# Altium schematic sheet Thruster_V1.0.SchDoc
size A2
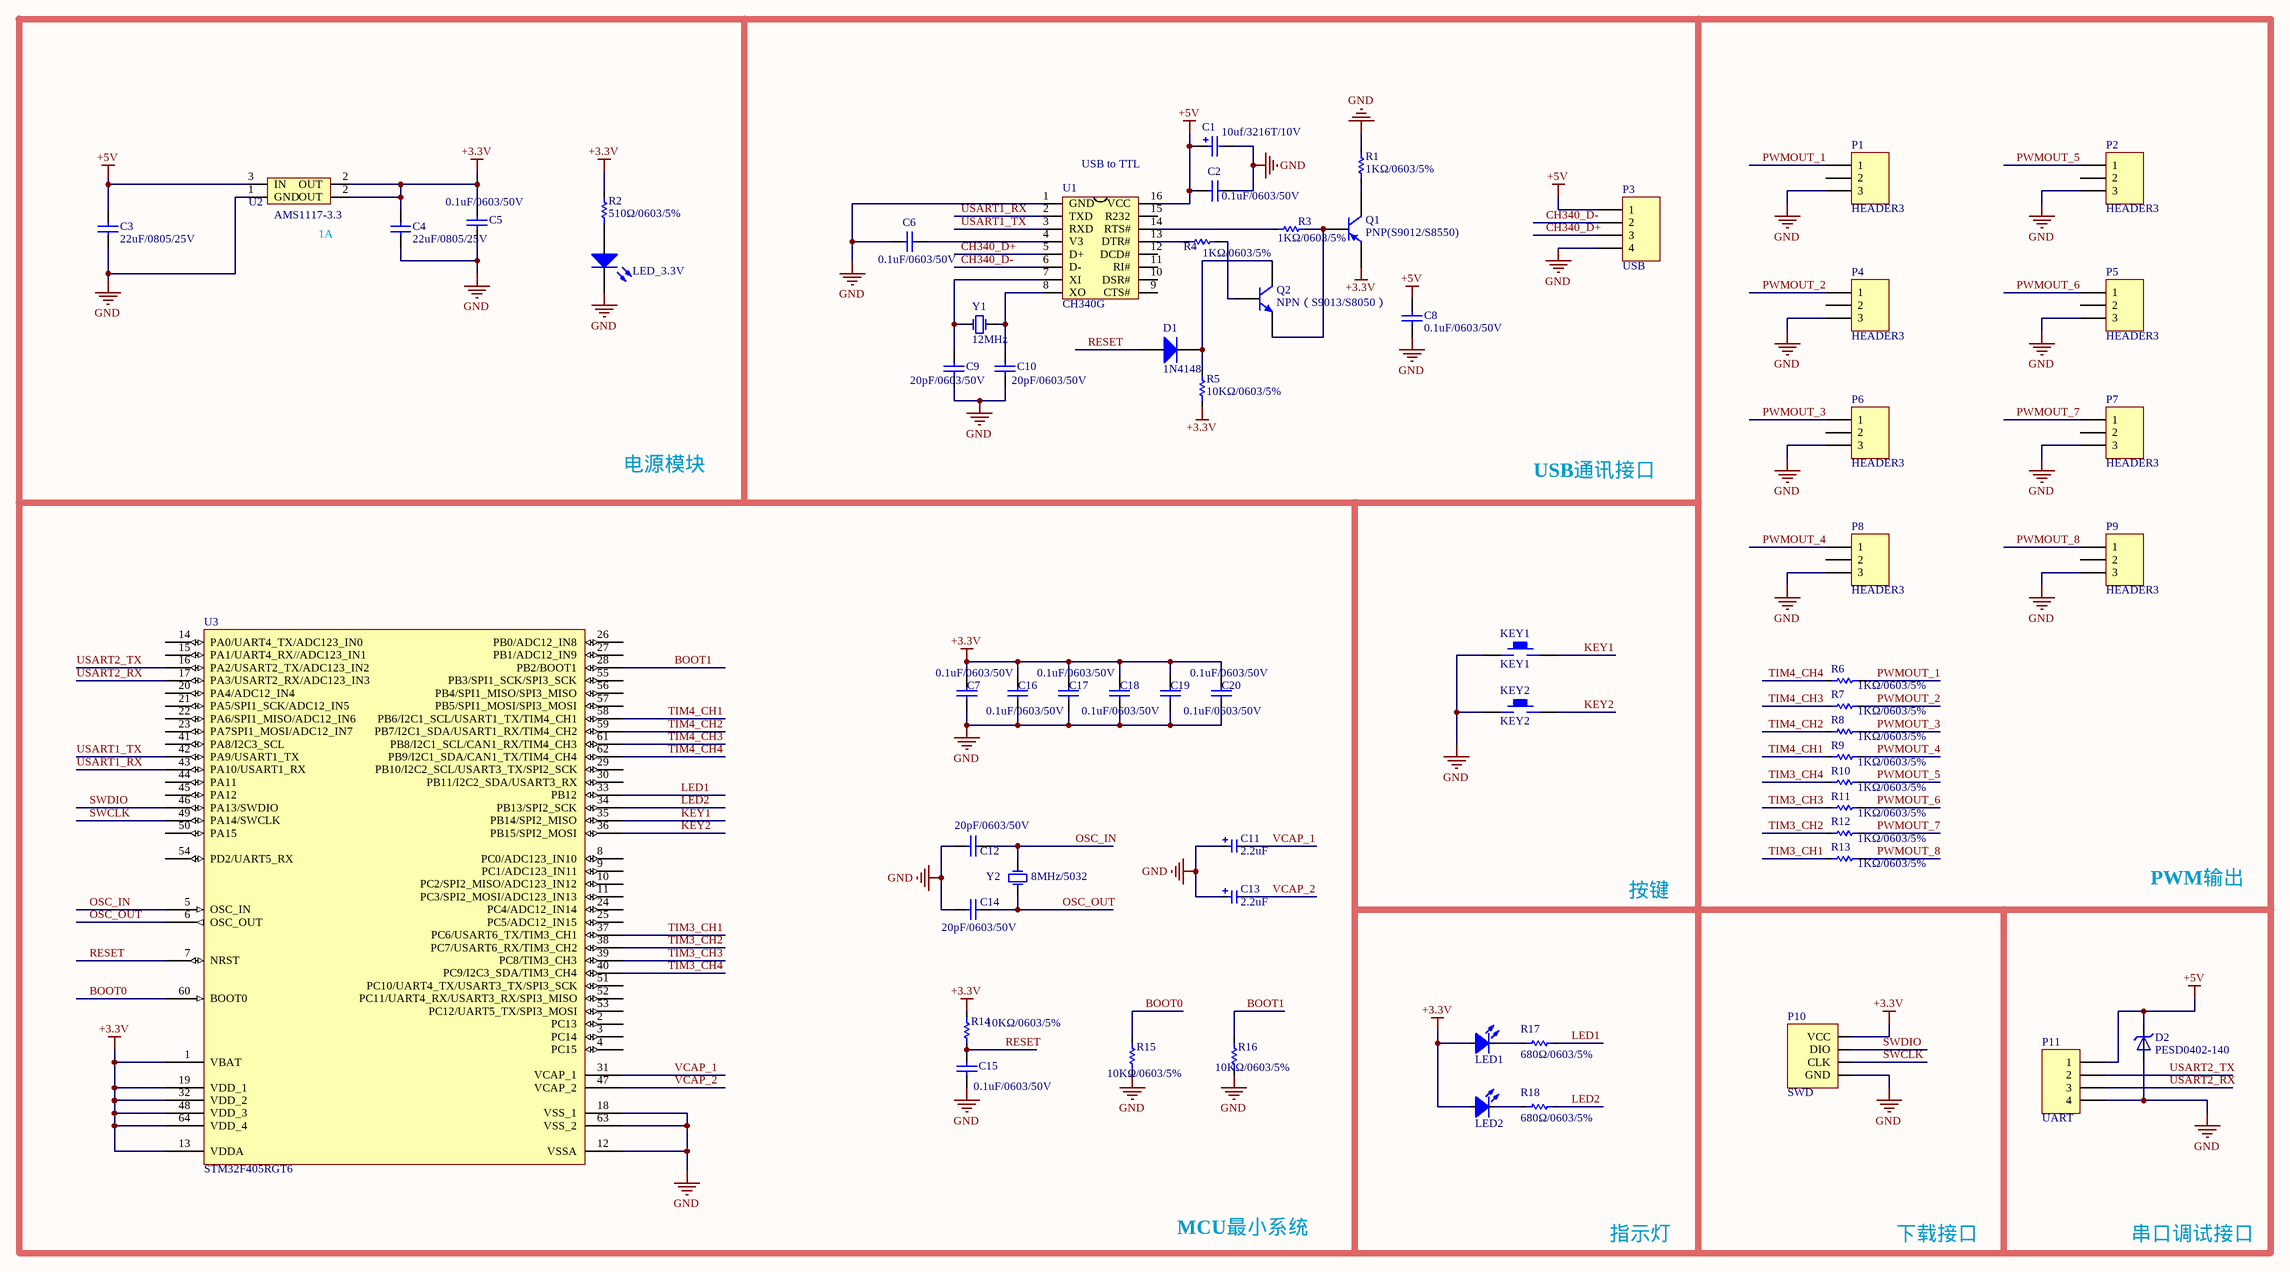
[diagram p0: Thruster_V1.0.SchDoc]

## Parts
C1  10uf/3216T/10V  [Cap Poll 1(3216T)]
C2  0.1uF/0603/50V  [0603C]
C3  value 22uF/0805/25V  [0805C]  (hidden comment: CAP)
C4  value 22uF/0805/25V  [0805C]  (hidden comment: CAP)
C5  0.1uF/0603/50V  [0603C]
C6  0.1uF/0603/50V  [0603C]
C7  0.1uF/0603/50V  [0603C]
C8  0.1uF/0603/50V  [0603C]
C9  20pF/0603/50V  [0603C]
C10  20pF/0603/50V  [0603C]
C11  value 2.2uF  [Cap_Tan_0805]  (hidden comment: Cap_Tan_0805)
C12  20pF/0603/50V  [0603C]
C13  value 2.2uF  [Cap_Tan_0805]  (hidden comment: Cap_Tan_0805)
C14  20pF/0603/50V  [0603C]
C15  0.1uF/0603/50V  [0603C]
C16  0.1uF/0603/50V  [0603C]
C17  0.1uF/0603/50V  [0603C]
C18  0.1uF/0603/50V  [0603C]
C19  0.1uF/0603/50V  [0603C]
C20  0.1uF/0603/50V  [0603C]
D1  1N4148  [1206D]
D2  PESD0402-140  [0402R]
KEY1  KEY1  [button-3x4x2mm 2 Pad]
KEY2  KEY2  [button-3x4x2mm 2 Pad]
LED1  LED_0603  [LED_0603_BLUE]  (value not drawn)
LED2  LED_0603  [LED_0603_RED]  (value not drawn)
LED_1  LED_3.3V  [LED_0603_RED]
P1  HEADER3  [HEADER3]
P2  HEADER3  [HEADER3]
P3  USB  [HEADER-GH1.25-4P]
P4  HEADER3  [HEADER3]
P5  HEADER3  [HEADER3]
P6  HEADER3  [HEADER3]
P7  HEADER3  [HEADER3]
P8  HEADER3  [HEADER3]
P9  HEADER3  [HEADER3]
P10  SWD  [HEADER-SH1.0-4P-A]
P11  UART  [HEADER-GH1.25-4P]
Q1  PNP(S9012/S8550)  [NPN(S8050/S9103)贴片]
Q2  NPN（S9013/S8050）  [NPN(S8050/S9103)贴片]
R1  1KΩ/0603/5%  [0603R]
R2  510Ω/0603/5%  [0603R]
R3  1KΩ/0603/5%  [0603R]
R4  1KΩ/0603/5%  [0603R]
R5  10KΩ/0603/5%  [0603R]
R6  1KΩ/0603/5%  [0603R]
R7  1KΩ/0603/5%  [0603R]
R8  1KΩ/0603/5%  [0603R]
R9  1KΩ/0603/5%  [0603R]
R10  1KΩ/0603/5%  [0603R]
R11  1KΩ/0603/5%  [0603R]
R12  1KΩ/0603/5%  [0603R]
R13  1KΩ/0603/5%  [0603R]
R14  10KΩ/0603/5%  [0603R]
R15  10KΩ/0603/5%  [0603R]
R16  10KΩ/0603/5%  [0603R]
R17  680Ω/0603/5%  [0603R]
R18  680Ω/0603/5%  [0603R]
U1  CH340G  [SOP16M]
U2  AMS1117-3.3  [AMS1117(SOT-223)]
U3  STM32F405RGT6  [STM32_LQFP64]
Y1  value 12MHz  [XT_5032_2P]  (hidden comment: 12MHz/5032)
Y2  8MHz/5032  [XT_5032_2P]

## Nets
+3.3V: C4.2 C5.1 C7.1 C16.1 C17.1 C18.1 C19.1 C20.1 LED1.1(A) LED2.1(A) P10.1(VCC) Q1.E R2.2 R5.2 R14.2 U2.2(OUT) U3.1(VBAT) U3.13(VDDA) U3.19(VDD_1) U3.32(VDD_2) U3.48(VDD_3) U3.64(VDD_4)
+5V: C1.1 C2.1 C3.2 C8.2 D2.2(K) P3.1 P11.1 U1.16(VCC) U2.3(IN)
GND: C1.2 C2.2 C3.1 C4.1 C5.2 C6.2 C7.2 C8.1 C9.1 C10.1 C11.1 C12.1 C13.1 C14.1 C15.2 C16.2 C17.2 C18.2 C19.2 C20.2 D2.1(A) KEY1.1 KEY2.1 LED_1.2(K) P1.3 P2.3 P3.4 P4.3 P5.3 P6.3 P7.3 P8.3 P9.3 P10.4(GND) P11.4 R1.1 R15.1 R16.1 U1.1(GND) U2.1(GND) U3.12(VSSA) U3.18(VSS_1) U3.63(VSS_2)
BOOT0: R15.2 U3.60(BOOT0)
BOOT1: R16.2 U3.28(PB2/BOOT1)
CH340_D+: P3.3 U1.5(D+)
CH340_D-: P3.2 U1.6(D-)
KEY1: KEY1.2 U3.35(PB14/SPI2_MISO)
KEY2: KEY2.2 U3.36(PB15/SPI2_MOSI)
LED1: R17.1 U3.33(PB12)
LED2: R18.1 U3.34(PB13/SPI2_SCK)
OSC_IN: C12.2 U3.5(OSC_IN) Y2.2(OSC2)
OSC_OUT: C14.2 U3.6(OSC_OUT) Y2.1(OSC1)
PWMOUT_1: P1.1 R6.1
PWMOUT_2: P4.1 R7.1
PWMOUT_3: P6.1 R8.1
PWMOUT_4: P8.1 R9.1
PWMOUT_5: P2.1 R10.1
PWMOUT_6: P5.1 R11.1
PWMOUT_7: P7.1 R12.1
PWMOUT_8: P9.1 R13.1
RESET: C15.1 D1.1(A) R14.1 U3.7(NRST)
SWCLK: P10.2(CLK) U3.49(PA14/SWCLK)
SWDIO: P10.3(DIO) U3.46(PA13/SWDIO)
TIM3_CH1: R13.2 U3.37(PC6/USART6_TX/TIM3_CH1)
TIM3_CH2: R12.2 U3.38(PC7/USART6_RX/TIM3_CH2)
TIM3_CH3: R11.2 U3.39(PC8/TIM3_CH3)
TIM3_CH4: R10.2 U3.40(PC9/I2C3_SDA/TIM3_CH4)
TIM4_CH1: R9.2 U3.58(PB6/I2C1_SCL/USART1_TX/TIM4_CH1)
TIM4_CH2: R8.2 U3.59(PB7/I2C1_SDA/USART1_RX/TIM4_CH2)
TIM4_CH3: R7.2 U3.61(PB8/I2C1_SCL/CAN1_RX/TIM4_CH3)
TIM4_CH4: R6.2 U3.62(PB9/I2C1_SDA/CAN1_TX/TIM4_CH4)
USART1_RX: U1.2(TXD) U3.43(PA10/USART1_RX)
USART1_TX: U1.3(RXD) U3.42(PA9/USART1_TX)
USART2_RX: P11.3 U3.17(PA3/USART2_RX/ADC123_IN3)
USART2_TX: P11.2 U3.16(PA2/USART2_TX/ADC123_IN2)
VCAP_1: C11.2 U3.31(VCAP_1)
VCAP_2: C13.2 U3.47(VCAP_2)
NetC6_1: C6.1 U1.4(V3)
NetC9_2: C9.2 U1.7(XI) Y1.2(OSC2)
NetC10_2: C10.2 U1.8(XO) Y1.1(OSC1)
NetD1_2: D1.2(K) Q2.C R5.1
NetLED1_2: LED1.2(K) R17.2
NetLED2_2: LED2.2(K) R18.2
NetLED_1_1: LED_1.1(A) R2.1
NetQ1_B: Q1.B Q2.E R3.1
NetQ1_C: Q1.C R1.2
NetQ2_B: Q2.B R4.1
NetR3_2: R3.2 U1.14(RTS#)
NetR4_2: R4.2 U1.13(DTR#)

Not connected (* = marked no-connect by the designer): P1 2; P2 2; P4 2; P5 2; P6 2; P7 2; P8 2; P9 2; U1 9(CTS#) 10(DSR#) 11(RI#) 12(DCD#) 15(R232); U3 2(PC13) 3(PC14) 4(PC15) 8(PC0/ADC123_IN10) 9(PC1/ADC123_IN11) 10(PC2/SPI2_MISO/ADC123_IN12) 11(PC3/SPI2_MOSI/ADC123_IN13) 14(PA0/UART4_TX/ADC123_IN0) 15(PA1/UART4_RX//ADC123_IN1) 20(PA4/ADC12_IN4) 21(PA5/SPI1_SCK/ADC12_IN5) 22(PA6/SPI1_MISO/ADC12_IN6) 23(PA7SPI1_MOSI/ADC12_IN7) 24(PC4/ADC12_IN14) 25(PC5/ADC12_IN15) 26(PB0/ADC12_IN8) 27(PB1/ADC12_IN9) 29(PB10/I2C2_SCL/USART3_TX/SPI2_SCK) 30(PB11/I2C2_SDA/USART3_RX) 41(PA8/I2C3_SCL) 44(PA11) 45(PA12) 50(PA15) 51(PC10/UART4_TX/USART3_TX/SPI3_SCK) 52(PC11/UART4_RX/USART3_RX/SPI3_MISO) 53(PC12/UART5_TX/SPI3_MOSI) 54(PD2/UART5_RX) 55(PB3/SPI1_SCK/SPI3_SCK) 56(PB4/SPI1_MISO/SPI3_MISO) 57(PB5/SPI1_MOSI/SPI3_MOSI)

## Notes on the sheet
- (near U1) USB to TTL
- (near U2) 1A
- 电源模块
- USB通讯接口
- 按键
- PWM输出
- MCU最小系统
- 指示灯
- 下载接口
- 串口调试接口

## Library data of the parts
C1 = Cap Poll: Polarized Capacitor (Surface Mount)(钽电容); value: 10uF
C2 C5 C6 C8-C10 C12 C14 C15 = CAP_0805/0603/0402: CAP 0805 0603 0402; Value: 0.1uF
C3 C4 = CAP_0805/0603/0402: CAP 0805 0603 0402
C7 C16-C20 = CAP_0805/0603/0402: CAP 0805 0603 0402; Value: 0.01uF
C11 C13 = Cap_Tan_0805: Polarized Capacitor (Surface Mount)(钽电容)
D1 = D
D2 = Diode-PESD0402-140: TVS二极管
KEY1 KEY2 = KEY: 按键
LED1 LED2 = LED_0603: LED
LED_1 = LED: Typical RED, GREEN, YELLOW, AMBER GaAs LED
P1 P2 P4-P9 = HEADER3: Header, 3-Pin
P3 P11 = HEADER4: Header, 4-Pin
P10 = SWD-下载接口: SWD调试下载接口
Q1 = PNP(S9012/S8550): PNP Bipolar Transistor
Q2 = NPN(S9103/S8050): NPN Bipolar Transistor
R1 R3-R16 = Res: Resistor; precision: 1%; power: 1/16W; Value: 10K
R2 = Res: Resistor; precision: 1%; power: 1/16W; Value: 510Ω
R17 R18 = Res: Resistor; Value: 10K; precision: 1%
U1 = CH340G: USB2UART
U2 = AMS1117
U3 = STM32F405RGT6: STM32 ARM-based 32-bit MCU with 1024 Kbytes of Flash memory, 64-pin LQFP, Industrial Temperature
Y1 = XTAL: Crystal Oscillator; Value: 32.768KHz
Y2 = XTAL: Crystal Oscillator; Value: 32.768KHz; Value: 8MHz